# EasyEDA schematic SCH_URM07-Test_2025-05-04.json
TITLE: Sheet_1; REV: 1.0; Date: 2025-04-24; Sheet: 1/1; Drawn By: dgasparyan073; Company: Your Company
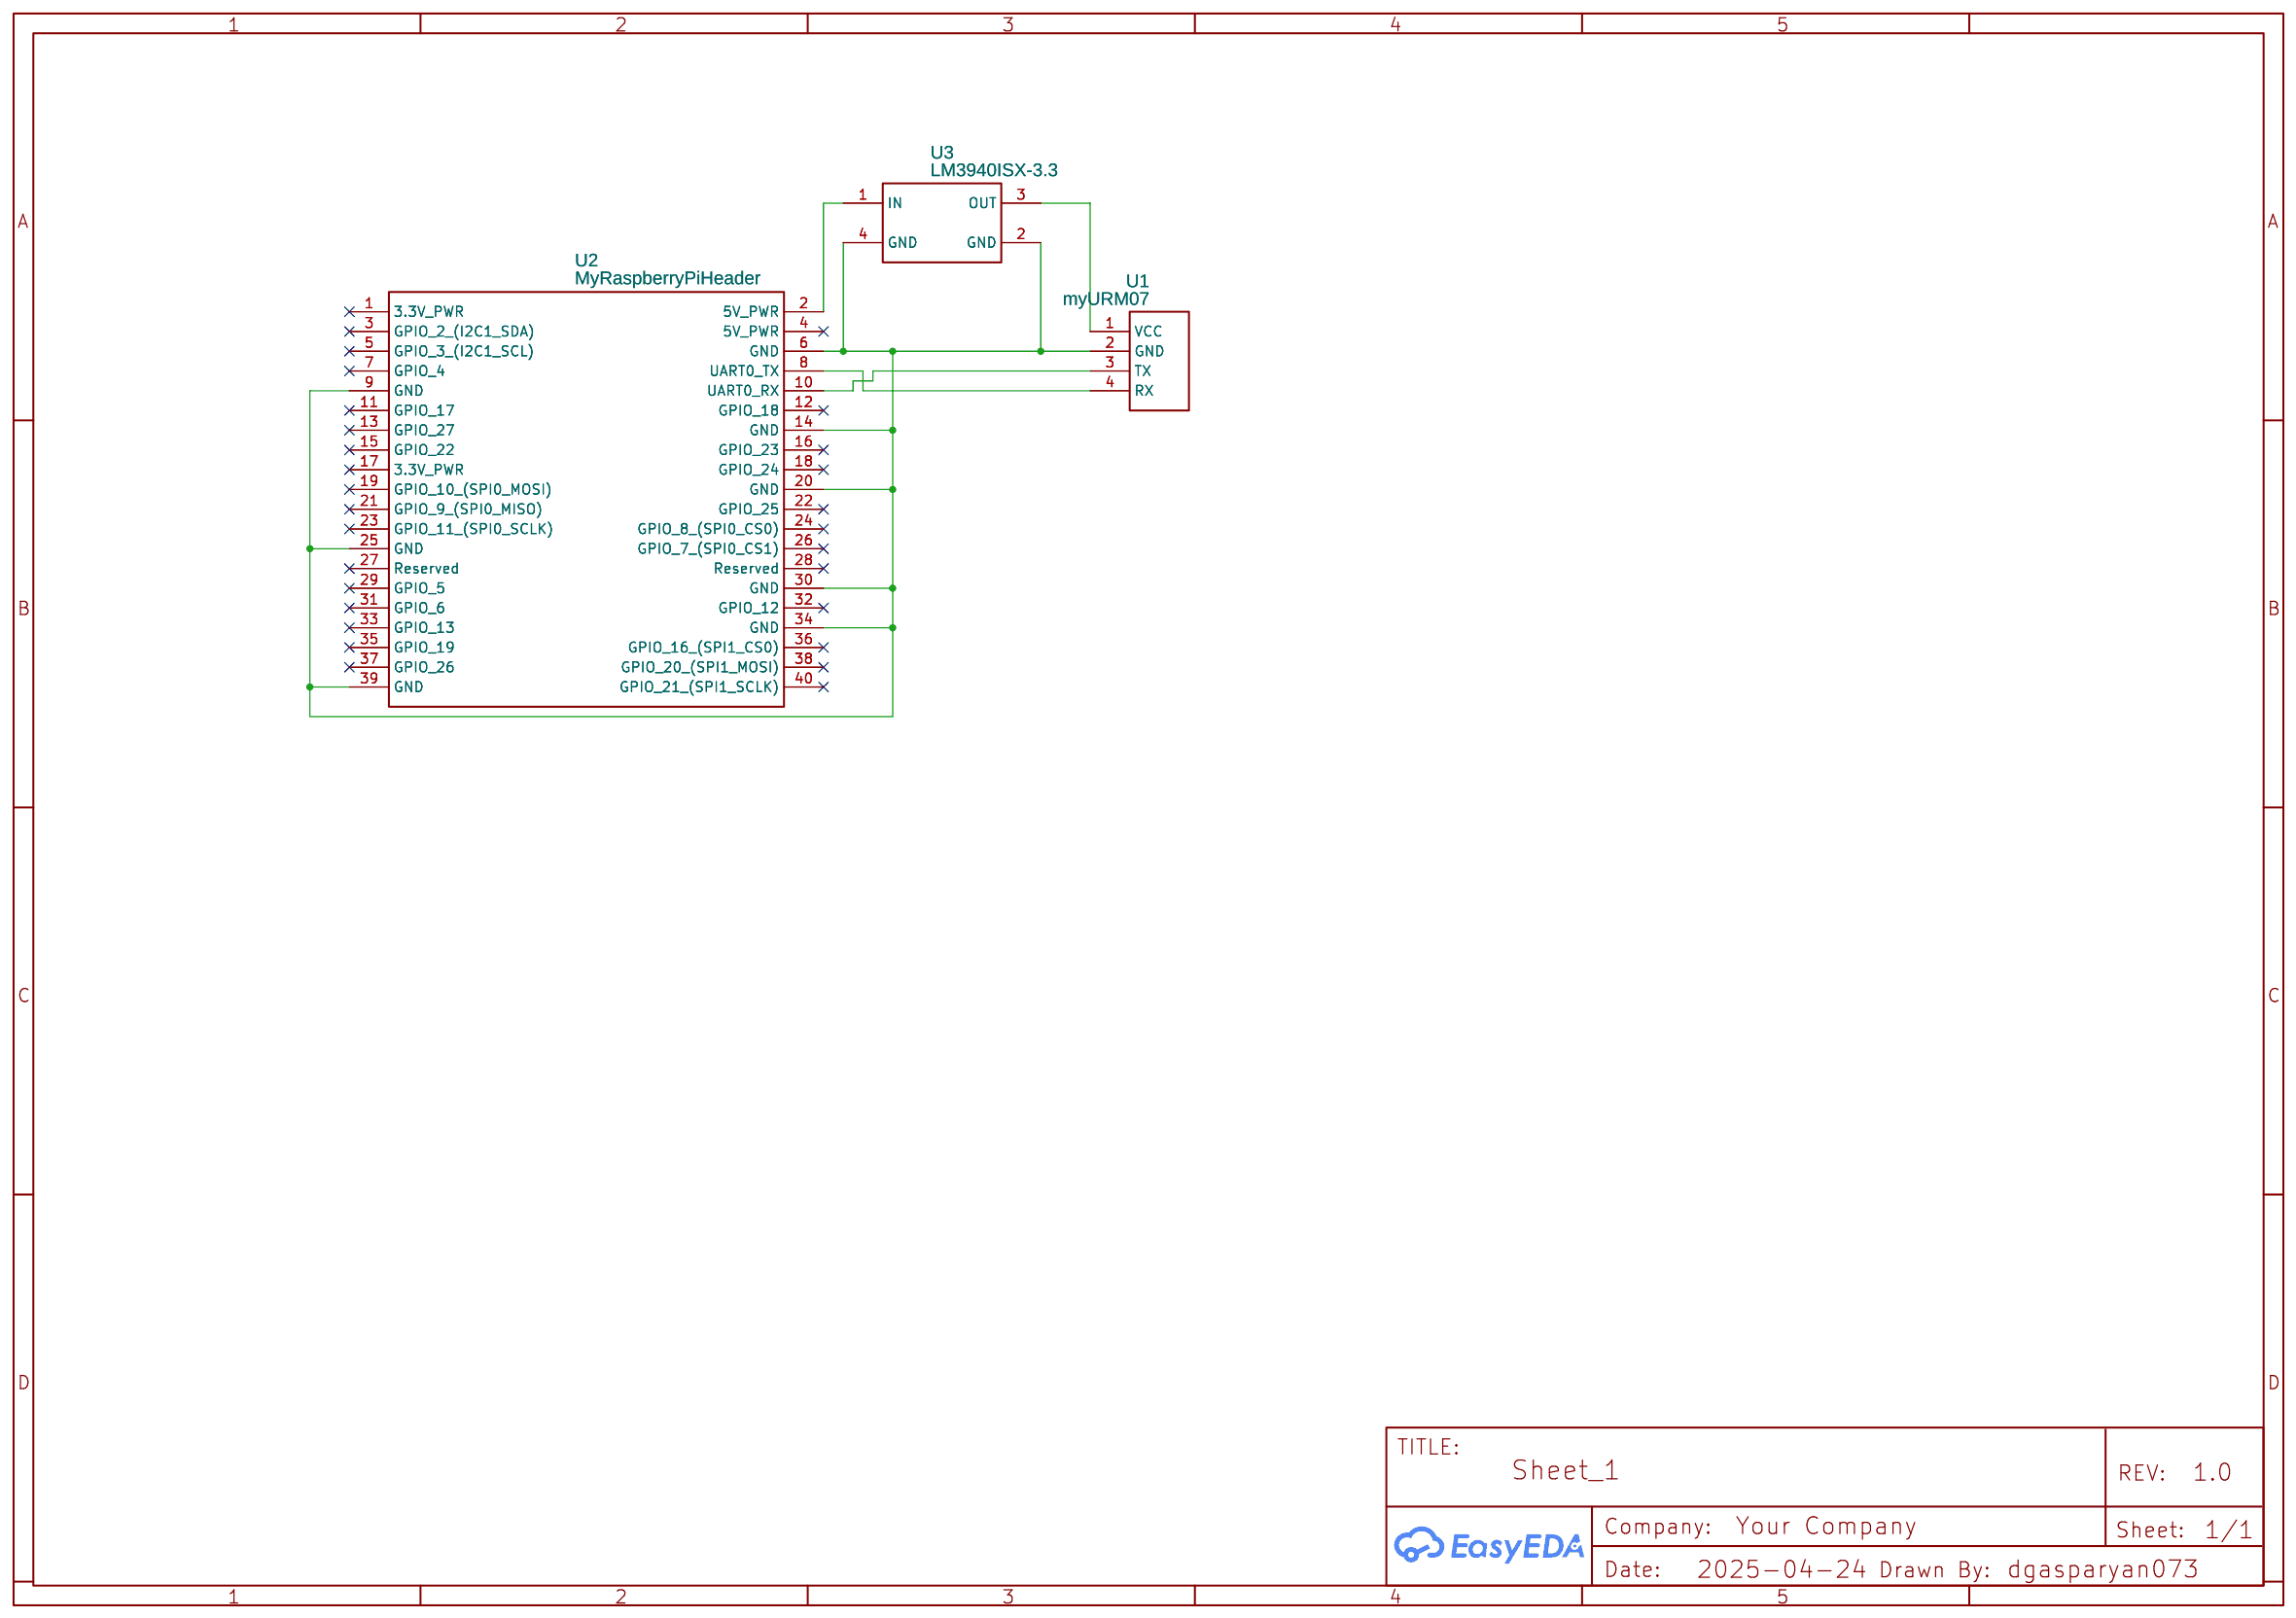
[diagram p0: schematic sheet]

## Parts
U1  myURM07  [MY_URM07]
U2  MyRaspberryPiHeader  [MY_RASPBERRY_PI_HEADER]
U3  LM3940ISX-3.3  [TO-263-3L_L10.0-W9.2-P2.54-TL]

## Library data of the parts
U1 = myURM07: Contributor: dgasparyan073
U2 = MyRaspberryPiHeader: Contributor: dgasparyan073
U3 = LM3940ISX-3.3: Supplier: LCSC; Manufacturer: TI(德州仪器); Manufacturer Part: LM3940ISX-3.3/NOPB; Supplier Part: C18910; JLCPCB Part Class: Extended Part

## Nets
Net-(U1-1): U1.1(VCC) U3.3(OUT)
Net-(U1-2): U1.2(GND) U2.6(GND) U2.9(GND) U2.14(GND) U2.20(GND) U2.25(GND) U2.30(GND) U2.34(GND) U2.39(GND) U3.2(GND) U3.4(GND)
Net-(U1-3): U1.3(TX) U2.10(UART0 RX)
Net-(U1-4): U1.4(RX) U2.8(UART0 TX)
Net-(U2-2): U2.2(5V PWR) U3.1(IN)

Not connected (* = marked no-connect by the designer): U2 1(3.3V PWR)* 3(GPIO 2 (I2C1 SDA))* 4(5V PWR)* 5(GPIO 3 (I2C1 SCL))* 7(GPIO 4)* 11(GPIO 17)* 12(GPIO 18)* 13(GPIO 27)* 15(GPIO 22)* 16(GPIO 23)* 17(3.3V PWR)* 18(GPIO 24)* 19(GPIO 10 (SPI0 MOSI))* 21(GPIO 9 (SPI0 MISO))* 22(GPIO 25)* 23(GPIO 11 (SPI0 SCLK))* 24(GPIO 8 (SPI0 CS0))* 26(GPIO 7 (SPI0 CS1))* 27(Reserved)* 28(Reserved)* 29(GPIO 5)* 31(GPIO 6)* 32(GPIO 12)* 33(GPIO 13)* 35(GPIO 19)* 36(GPIO 16 (SPI1 CS0))* 37(GPIO 26)* 38(GPIO 20 (SPI1 MOSI))* 40(GPIO 21 (SPI1 SCLK))*
